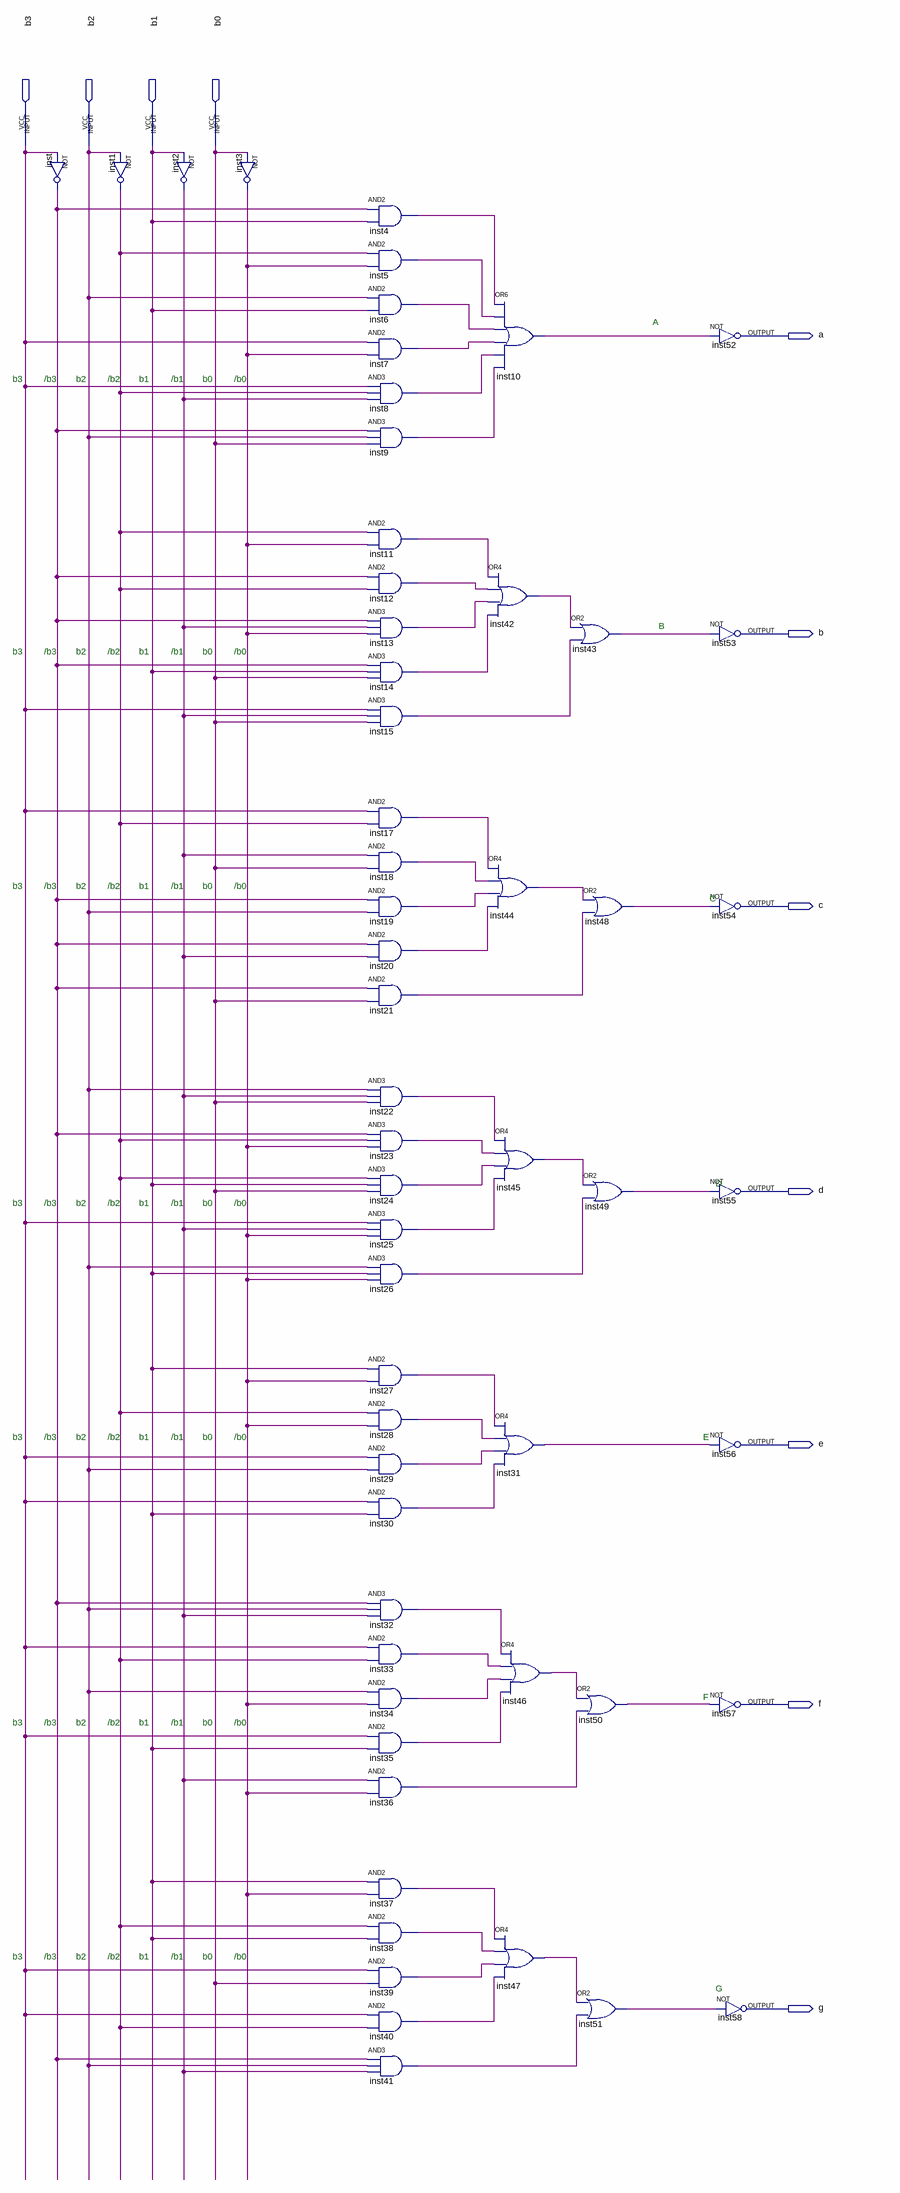
[diagram p0: schematic sheet]
// Quartus schematic num_led.bdf as structural Verilog: 58 symbols, 11 pins
module num_led (
  input  b3,
  input  b2,
  input  b1,
  input  b0,
  output a,
  output b,
  output c,
  output d,
  output e,
  output f,
  output g
);

  wire inst1_out, inst2_out, inst3_out, inst4_out, inst5_out, inst6_out, inst7_out, inst8_out, inst9_out,
       inst10_out, inst11_out, inst12_out, inst13_out, inst14_out, inst15_out, inst17_out, inst18_out,
       inst19_out, inst20_out, inst21_out, inst22_out, inst23_out, inst24_out, inst25_out, inst26_out,
       inst27_out, inst28_out, inst29_out, inst30_out, inst31_out, inst32_out, inst33_out, inst34_out,
       inst35_out, inst36_out, inst37_out, inst38_out, inst39_out, inst40_out, inst41_out, inst42_out,
       inst43_out, inst44_out, inst45_out, inst46_out, inst47_out, inst48_out, inst49_out, inst50_out,
       inst51_out, inst_out;

  not inst (inst_out, b3);
  not inst1 (inst1_out, b2);
  not inst2 (inst2_out, b1);
  not inst3 (inst3_out, b0);
  and inst4 (inst4_out, inst_out, b1);
  and inst5 (inst5_out, inst1_out, inst3_out);
  and inst6 (inst6_out, b2, b1);
  and inst7 (inst7_out, b3, inst3_out);
  and inst8 (inst8_out, b3, inst1_out, inst2_out);
  and inst9 (inst9_out, inst_out, b2, b0);
  and inst11 (inst11_out, inst1_out, inst3_out);
  and inst12 (inst12_out, inst_out, inst1_out);
  and inst13 (inst13_out, inst_out, inst2_out, inst3_out);
  and inst14 (inst14_out, inst_out, b1, b0);
  and inst15 (inst15_out, b3, inst2_out, b0);
  and inst17 (inst17_out, b3, inst1_out);
  and inst18 (inst18_out, inst2_out, b0);
  and inst19 (inst19_out, inst_out, b2);
  and inst20 (inst20_out, inst_out, inst2_out);
  and inst21 (inst21_out, inst_out, b0);
  and inst22 (inst22_out, b2, inst2_out, b0);
  and inst23 (inst23_out, inst_out, inst1_out, inst3_out);
  and inst24 (inst24_out, inst1_out, b1, b0);
  and inst25 (inst25_out, b3, inst2_out, inst3_out);
  and inst26 (inst26_out, b2, b1, inst3_out);
  and inst27 (inst27_out, b1, inst3_out);
  and inst28 (inst28_out, inst1_out, inst3_out);
  and inst29 (inst29_out, b3, b2);
  and inst30 (inst30_out, b3, b1);
  and inst32 (inst32_out, inst_out, b2, inst2_out);
  and inst33 (inst33_out, b3, inst1_out);
  and inst34 (inst34_out, b2, inst3_out);
  and inst35 (inst35_out, b3, b1);
  and inst36 (inst36_out, inst2_out, inst3_out);
  and inst37 (inst37_out, b1, inst3_out);
  and inst38 (inst38_out, inst1_out, b1);
  and inst39 (inst39_out, b3, b0);
  and inst40 (inst40_out, b3, inst1_out);
  and inst41 (inst41_out, inst_out, b2, inst2_out);
  or inst10 (inst10_out, inst4_out, inst5_out, inst6_out, inst7_out, inst8_out, inst9_out);
  or inst42 (inst42_out, inst11_out, inst12_out, inst13_out, inst14_out);
  or inst44 (inst44_out, inst17_out, inst18_out, inst19_out, inst20_out);
  or inst45 (inst45_out, inst22_out, inst23_out, inst24_out, inst25_out);
  or inst31 (inst31_out, inst27_out, inst28_out, inst29_out, inst30_out);
  or inst46 (inst46_out, inst32_out, inst33_out, inst34_out, inst35_out);
  or inst47 (inst47_out, inst37_out, inst38_out, inst39_out, inst40_out);
  or inst43 (inst43_out, inst42_out, inst15_out);
  or inst48 (inst48_out, inst44_out, inst21_out);
  or inst49 (inst49_out, inst45_out, inst26_out);
  or inst50 (inst50_out, inst46_out, inst36_out);
  or inst51 (inst51_out, inst47_out, inst41_out);
  not inst52 (a, inst10_out);
  not inst53 (b, inst43_out);
  not inst54 (c, inst48_out);
  not inst55 (d, inst49_out);
  not inst56 (e, inst31_out);
  not inst57 (f, inst50_out);
  not inst58 (g, inst51_out);

  // Notes on the sheet:
  //   A
  //   b3
  //   /b3
  //   b2
  //   /b2
  //   b1
  //   /b1
  //   b0
  //   /b0
  //   B
  //   b3
  //   /b3
  //   b2
  //   /b2
  //   b1
  //   /b1
  //   b0
  //   /b0
  //   b3
  //   /b3
  //   b2
  //   /b2
  //   b1
  //   /b1
  //   b0
  //   /b0
  //   C
  //   D
  //   b3
  //   /b3
  //   b2
  //   /b2
  //   b1
  //   /b1
  //   b0
  //   /b0
  //   b3
  //   /b3
  //   b2
  //   /b2
  //   b1
  //   /b1
  //   b0
  //   /b0
  //   E
  //   F
  //   b3
  //   /b3
  //   b2
  //   /b2
  //   b1
  //   /b1
  //   b0
  //   /b0
  //   b3
  //   /b3
  //   b2
  //   /b2
  //   b1
  //   /b1
  //   b0
  //   /b0
  //   G
endmodule
